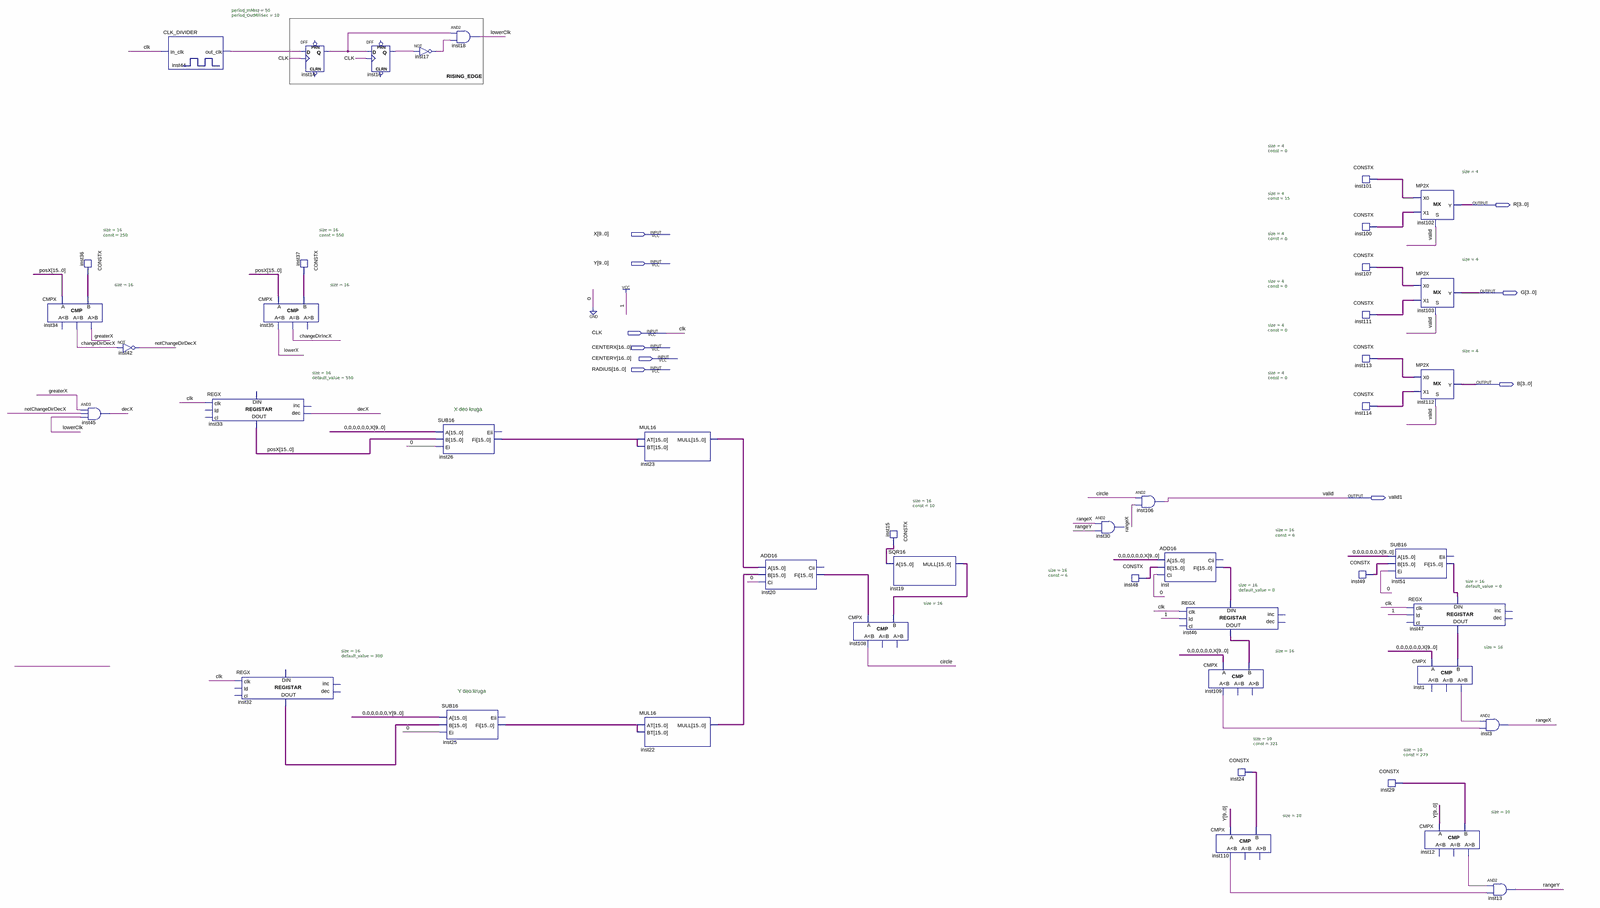
[diagram p0: schematic sheet, whole]
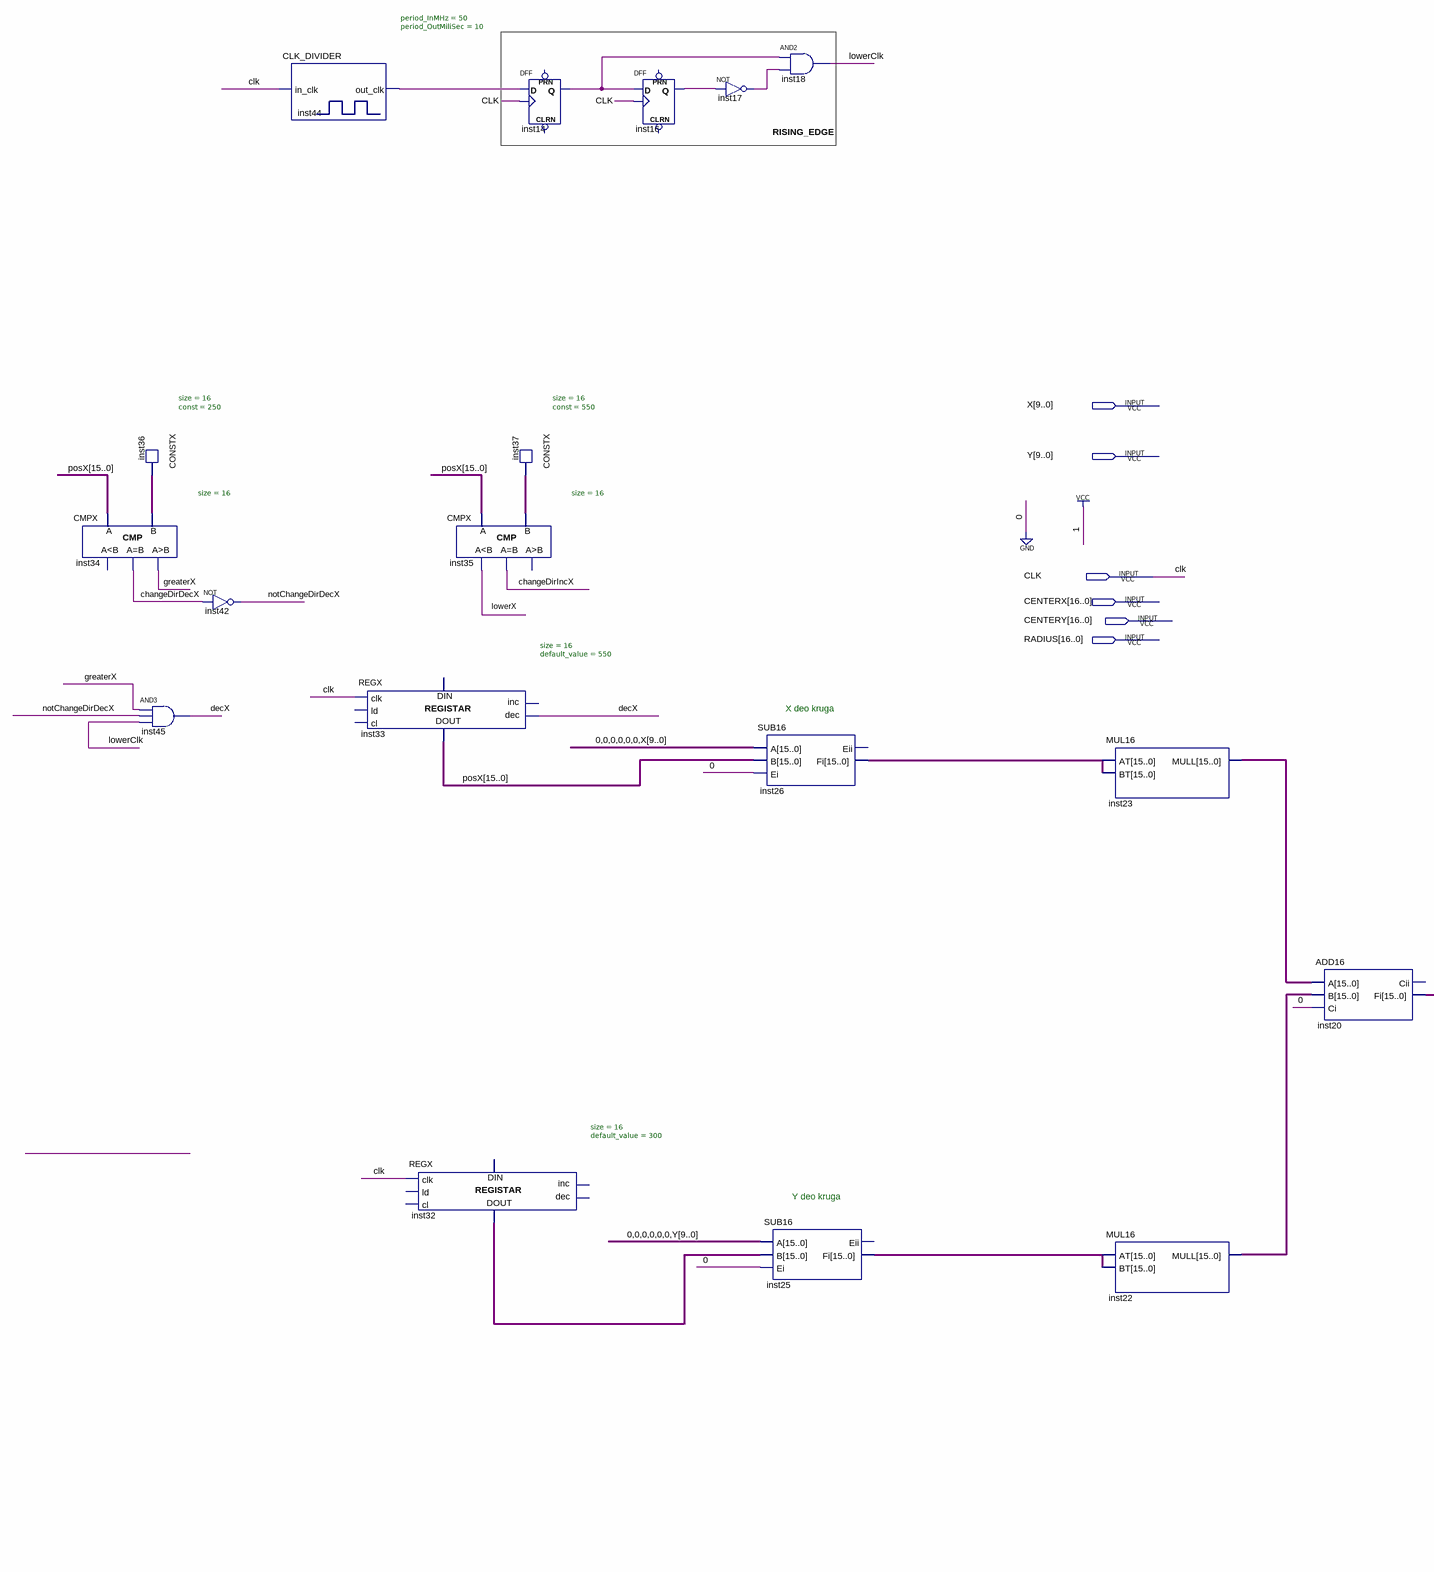
[diagram p1: schematic sheet, left part]
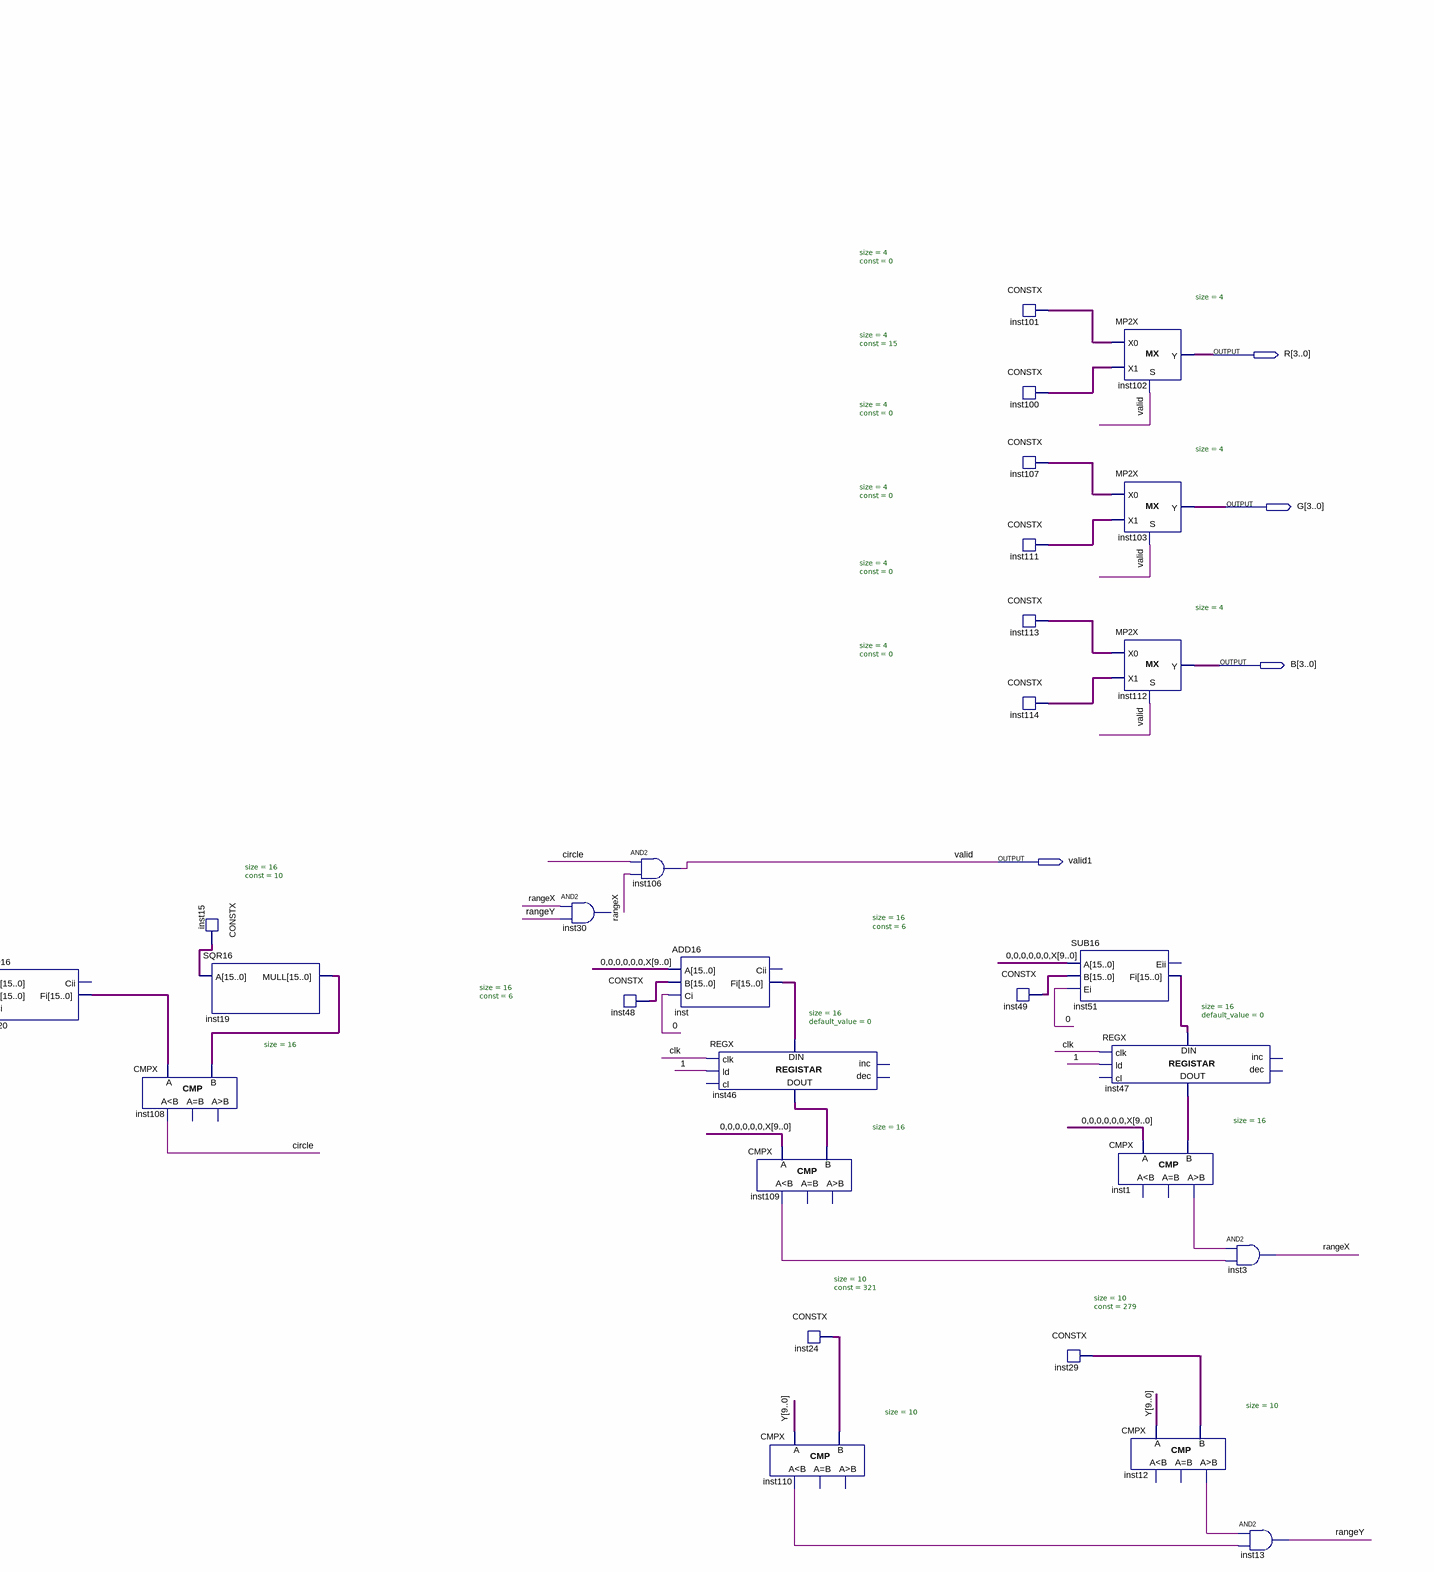
[diagram p2: schematic sheet, right part]
// Quartus schematic proba.bdf as structural Verilog: 46 symbols, 10 pins
module proba (
  input  [9:0] X,
  input  [9:0] Y,
  input  CLK,
  input  [16:0] CENTERX,
  input  [16:0] CENTERY,
  input  [16:0] RADIUS,
  output [3:0] R,
  output [3:0] G,
  output [3:0] B,
  output valid1
);

  wire changeDirDecX, changeDirIncX, circle, decX, greaterX, inst1_gr, inst12_gr, inst14_q, inst16_q,
       inst17_out, inst44_out_clk, inst109_ls, inst110_ls, lowerClk, lowerX, notChangeDirDecX, rangeX, rangeY;
  wire [3:0] inst100_data, inst101_data, inst107_data, inst111_data, inst113_data, inst114_data;
  wire [9:0] inst24_data, inst29_data;
  wire [15:0] inst15_data, inst19_mull, inst20_fi, inst22_mull, inst23_mull, inst25_fi, inst26_fi,
       inst32_data_out, inst36_data, inst37_data, inst46_data_out, inst47_data_out, inst48_data, inst49_data,
       inst51_fi, inst_fi, posX;

  CMPX #(.size(16)) inst34 (.A(posX), .B(inst36_data), .eq(changeDirDecX), .gr(greaterX));  // open: ls
  CONSTX #(.size(16), .\const (250)) inst36 (.data(inst36_data));
  and inst45 (decX, greaterX, notChangeDirDecX, lowerClk);
  not inst42 (notChangeDirDecX, changeDirDecX);
  CLK_DIVIDER #(.period_InMHz(50), .period_OutMiliSec(10)) inst44 (.in_clk(CLK), .out_clk(inst44_out_clk));
  REGX #(.size(16), .default_value(550)) inst33 (.clk(CLK), .dec(decX), .data_out(posX));  // open: ld, cl, inc, data_in
  REGX #(.size(16), .default_value(300)) inst32 (
    .clk(CLK), .data_out(inst32_data_out));  // open: ld, cl, inc, dec, data_in
  CMPX #(.size(16)) inst35 (.A(posX), .B(inst37_data), .ls(lowerX), .eq(changeDirIncX));  // open: gr
  CONSTX #(.size(16), .\const (550)) inst37 (.data(inst37_data));
  DFF inst14 (.CLK(CLK), .D(inst44_out_clk), .Q(inst14_q));  // open: CLRN, PRN
  DFF inst16 (.CLK(CLK), .D(inst14_q), .Q(inst16_q));  // open: CLRN, PRN
  not inst17 (inst17_out, inst16_q);
  SUB16 inst26 (.A({{6{1'b0}}, X}), .B(posX), .Ei(1'b0), .Fi(inst26_fi));  // open: Eii
  SUB16 inst25 (.A({{6{1'b0}}, Y}), .B(inst32_data_out), .Ei(1'b0), .Fi(inst25_fi));  // open: Eii
  and inst18 (lowerClk, inst14_q, inst17_out);
  MUL16 inst23 (.AT(inst26_fi), .BT(inst26_fi), .MULL(inst23_mull));
  MUL16 inst22 (.AT(inst25_fi), .BT(inst25_fi), .MULL(inst22_mull));
  ADD16 inst20 (.A(inst23_mull), .B(inst22_mull), .Ci(1'b0), .Fi(inst20_fi));  // open: Cii
  CMPX #(.size(16)) inst108 (.A(inst20_fi), .B(inst19_mull), .ls(circle));  // open: eq, gr
  CONSTX #(.size(16), .\const (10)) inst15 (.data(inst15_data));
  SQR16 inst19 (.A(inst15_data), .MULL(inst19_mull));
  // AND2 inst30 has open pins: IN1=rangeX, IN2=rangeY, OUT=open
  and inst106 (valid1, circle, rangeX);
  CONSTX #(.size(16), .\const (6)) inst48 (.data(inst48_data));
  ADD16 inst (.A({{6{1'b0}}, X}), .B(inst48_data), .Ci(1'b0), .Fi(inst_fi));  // open: Cii
  REGX #(.size(16), .default_value(0)) inst46 (
    .clk(CLK), .ld(1'b1), .data_in(inst_fi), .data_out(inst46_data_out));  // open: cl, inc, dec
  CMPX #(.size(16)) inst109 (.A({{6{1'b0}}, X}), .B(inst46_data_out), .ls(inst109_ls));  // open: eq, gr
  CONSTX #(.size(10), .\const (321)) inst24 (.data(inst24_data));
  CMPX #(.size(10)) inst110 (.A(Y), .B(inst24_data), .ls(inst110_ls));  // open: eq, gr
  CONSTX #(.size(16), .\const (6)) inst49 (.data(inst49_data));
  CONSTX #(.size(4), .\const (0)) inst101 (.data(inst101_data));
  CONSTX #(.size(4), .\const (15)) inst100 (.data(inst100_data));
  CONSTX #(.size(4), .\const (0)) inst107 (.data(inst107_data));
  CONSTX #(.size(4), .\const (0)) inst111 (.data(inst111_data));
  CONSTX #(.size(4), .\const (0)) inst113 (.data(inst113_data));
  CONSTX #(.size(4), .\const (0)) inst114 (.data(inst114_data));
  CONSTX #(.size(10), .\const (279)) inst29 (.data(inst29_data));
  SUB16 inst51 (.A({{6{1'b0}}, X}), .B(inst49_data), .Ei(1'b0), .Fi(inst51_fi));  // open: Eii
  REGX #(.size(16), .default_value(0)) inst47 (
    .clk(CLK), .ld(1'b1), .data_in(inst51_fi), .data_out(inst47_data_out));  // open: cl, inc, dec
  MP2X #(.size(4)) inst102 (.S(valid1), .X0(inst101_data), .X1(inst100_data), .Y(R));
  MP2X #(.size(4)) inst103 (.S(valid1), .X0(inst107_data), .X1(inst111_data), .Y(G));
  MP2X #(.size(4)) inst112 (.S(valid1), .X0(inst113_data), .X1(inst114_data), .Y(B));
  CMPX #(.size(16)) inst1 (.A({{6{1'b0}}, X}), .B(inst47_data_out), .gr(inst1_gr));  // open: ls, eq
  CMPX #(.size(10)) inst12 (.A(Y), .B(inst29_data), .gr(inst12_gr));  // open: ls, eq
  and inst3 (rangeX, inst1_gr, inst109_ls);
  and inst13 (rangeY, inst12_gr, inst110_ls);

  // Other names for the same wires on the sheet: valid = valid1

  // Notes on the sheet:
  //   RISING_EDGE
  //   X deo kruga
  //   Y deo kruga
endmodule
